# EAGLE design stroboscope (EAGLE 8.6.0)
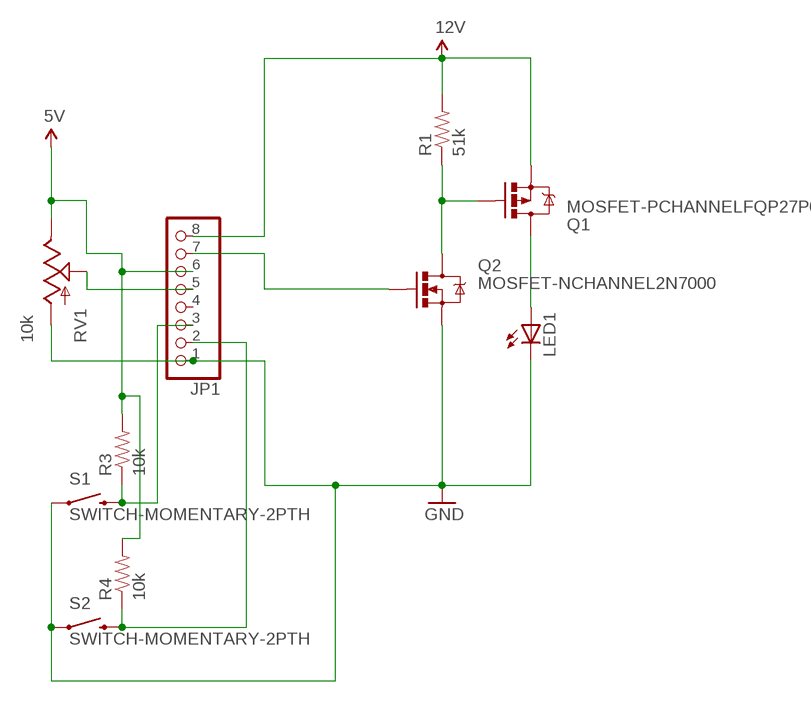
[diagram p0: schematic, sheet 1]

## Parts
JP1  PINHD-1X8BIG  [1X08-BIG]
LED1  LEDSQR2X5  [LED2X5]
Q1  MOSFET-PCHANNELFQP27P06  [TO220V]
Q2  MOSFET-NCHANNEL2N7000  [TO-92]
R1  51k  RESISTORPTH-1/4W  [AXIAL-0.4]
R3  10k  RESISTORPTH-1/4W  [AXIAL-0.4]
R4  10k  RESISTORPTH-1/4W  [AXIAL-0.4]
RV1  10k  POT  [ALPS_POT]
S1  SWITCH-MOMENTARY-2PTH  [TACTILE-PTH]
S2  SWITCH-MOMENTARY-2PTH  [TACTILE-PTH]

## Nets
5V: JP1.6 R3.P$2 R4.P$2 RV1.P$1(E)
12V: JP1.8 Q1.3(S) R1.P$2
GND: JP1.1 LED1.K(C) Q2.1(S) RV1.P$3(A) S1.1 S2.1
OUT: LED1.A Q1.2(D)
POT_SIG: JP1.5 RV1.P$2(S)
PWR_GATE: Q1.1(G) Q2.3(D) R1.P$1
SIG: JP1.7 Q2.2(G)
SW1_SIG: JP1.3 R3.P$1 S1.3
SW2_SIG: JP1.2 R4.P$1 S2.3
Unconnected: JP1.4

## Library data of the parts
JP1 = adafruit:PINHD-1X8: PIN HEADER
LED1 = adafruit:LED: LED OSRAM: - CHIPLED LG R971, LG N971, LY N971, LG Q971, LY Q971, LO R971, LY R971 LH N974, LH R974 LS Q976, LO Q976, LY Q976 LO Q996 - Hyper CHIPLED LW Q18S LB Q993, LB Q99A, LB R99A - SideLED LS A670, LO A670, LY A670, LG A670, LP A670 LB A673, LV A673, LT A673, LW A673 LH A674 LY A675 LS A676, LA A676, LO A676, LY A676, LW A676 LS A679, LY A679, LG A679 - Hyper Micro SIDELED® LS Y876, LA Y876, LO Y876, LY Y876 LT Y87S - SmartLED LW L88C, LW L88S LB L89C, LB L89S, LG L890 LS L89K, LO L89K, LY L89K LS L896, LA L896, LO L896, LY L896 - TOPLED LS T670, LO T670, LY T670, LG T670, LP T670 LSG T670, LSP T670, LSY T670, LOP T670, LYG T670 LG T671, LOG T671, LSG T671 LB T673, LV T673, LT T673, LW T673 LH T674 LS T676, LA T676, LO T676, LY T676, LB T676, LH T676, LSB T676, LW T676 LB T67C, LV T67C, LT T67C, LS T67K, LO T67K, LY T67K, LW E67C LS E67B, LA E67B, LO E67B, LY E67B, LB E67C, LV E67C, LT E67C LW T67C LS T679, LY T679, LG T679 LS T770, LO T770, LY T770, LG T770, LP T770 LB T773, LV T773, LT T773, LW T773 LH T774 LS E675, LA E675, LY E675, LS T675 LS T776, LA T776, LO T776, LY T776, LB T776 LHGB T686 LT T68C, LB T68C - Hyper Mini TOPLED® LB M676 - Mini TOPLED Santana® LG M470 LS M47K, LO M47K, LY M47K Source: http://www.osram.convergy.de/
Q1 = SparkFun-DiscreteSemi:MOSFET-PCHANNEL: Generic PMOSFET IRLML2244 - TRANS-11153 (SOT-23 -20V -4.3A) (1.Gate 2.Source 3.Drain) FQP27P06 - COM-10349 <http://www.sparkfun.com/products/10349> (TO-220 -60V -27A) (1.Gate 2.Source 3.Drain)
Q2 = SparkFun-DiscreteSemi:MOSFET-NCHANNEL: Common NMOSFET Parts MFG P/N Store ID Prod ID FDD8780 TRANS-09984 SI7820DN TRANS-11055 FDS6630A IC-08089 2N7002PW TRANS-11151 FQP30N06L COM-10213 TRANS-10060 BSS123LT1G TRANS-08345 BSS138 TRANS-00830 BS170 2N7000
R1 R3 R4 = SparkFun-Passives:RESISTOR: Resistor Basic schematic elements and footprints for 0603, 1206, and PTH resistors.
RV1 = SparkFun-Electromechanical:POT
S1 S2 = SparkFun-Electromechanical:SWITCH-MOMENTARY-2: Various NO switches- pushbuttons, reed, etc

## Board
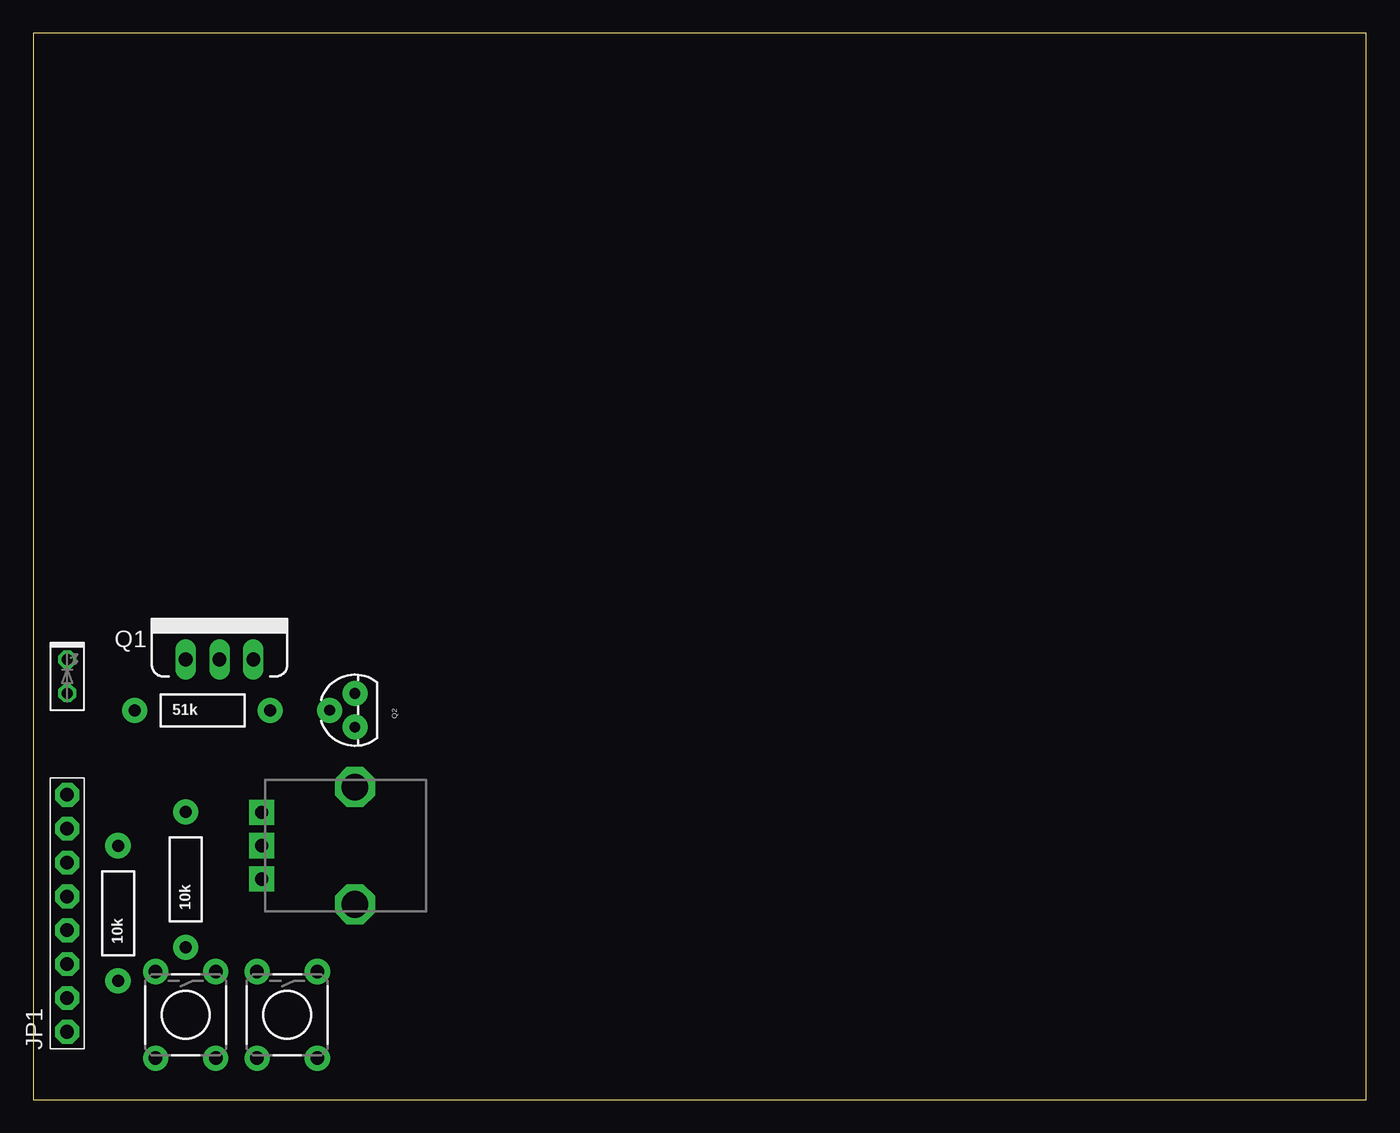
[diagram p1: board, top side]
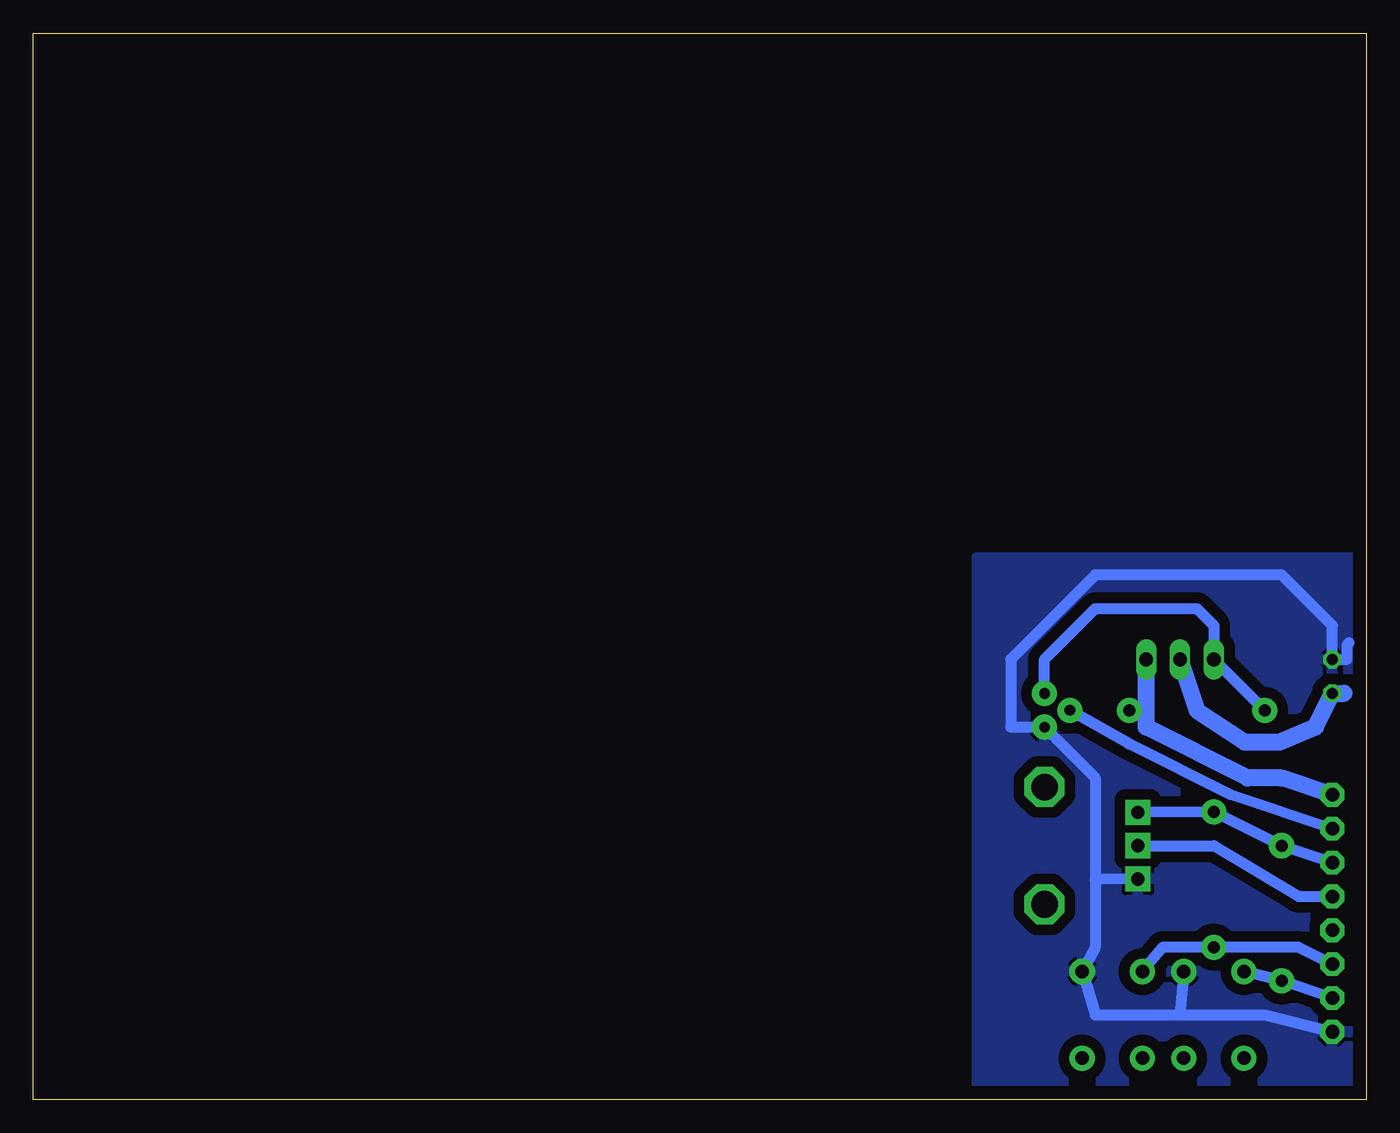
[diagram p2: board, bottom side, seen from below]

Size 100 x 80 mm. Coordinates in mm from the lower left corner, seen from the top.
Outline: 0,0 100,0 100,80 0,80 0,0
Copper layers (1*16): Top 0.035mm / dielectric 1.5mm / Bottom 0.035mm
Design rules "default": minimum track width 6mil, minimum drill 0.35mm, track to track 6mil, track to pad 6mil, pad to pad 6mil, via to via 6mil, smd to smd 6mil, copper to edge 40mil, drill to drill 6mil, minimum pad ring 10mil, minimum via ring 8mil, stop-mask expansion 4mil, vias tented up to drill 0mil, thermal gap 10mil

### Footprints (pad centres in the part's own frame; a part is rotated, then mirrored left to right if it is on the bottom)
1X08-BIG = drill 1.016 pad 1.778 octagon: 1 -8.89,0; 2 -6.35,0; 3 -3.81,0; 4 -1.27,0; 5 1.27,0; 6 3.81,0; 7 6.35,0; 8 8.89,0
LED2X5 = drill 0.813 octagon: A -1.27,0; K 1.27,0
TO220V = drill 1.016 long: 1 -2.54,0; 2 0,0; 3 2.54,0
TO-92 = drill 0.813 pad 1.88: 1 -1.27,0; 2 0,1.905; 3 1.27,0
AXIAL-0.4 = drill 0.9 pad 1.88: P$1 -5.08,0; P$2 5.08,0
ALPS_POT = drill 1 pad 1.88 square: P$1 7,-2.5; P$2 7,0; P$3 7,2.5 | drill 2 octagon: P$4 0,-4.4; P$5 0,4.4
TACTILE-PTH = drill 1.016 pad 1.88: 1 -3.251,2.261; 2 3.251,2.261; 3 -3.251,-2.261; 4 3.251,-2.261

### Placement (x,y rotation side)
JP1  2.54,13.97 90 top
LED1  2.54,31.75 90 top
Q1  13.97,33.02 0 top
Q2  24.13,29.21 90 top
R1  12.7,29.21 0 top
R3  11.43,16.51 90 top
R4  6.35,13.97 90 top
RV1  24.13,19.05 180 top
S1  19.05,6.35 270 top
S2  11.43,6.35 270 top

### Tracks (layer width: path | path; a pad name or v marks a point on that pad's centre or on a via)
5V
  Bottom 0.813: JP1.6 R4.P$2 R3.P$2 RV1.P$1
12V
  Bottom 1.27: 16.51,29.21 16.51,27.94 8.89,24.13 6.35,24.13 JP1.8 | 16.51,29.21 Q1.3 | R1.P$2 16.51,29.21
GND
  Bottom 0.813: 20.32,16.51 20.32,24.13 Q2.1 26.67,27.94 26.67,33.02 20.32,39.37 6.35,39.37 2.54,35.56 LED1.K 1.42,33.02 1.42,34.03 arc45 1.35,34.21 1.27,34.29 | 20.32,16.51 20.32,11.43 S1.1 20.32,6.35 13.97,6.35 | RV1.P$3 20.32,16.51 | 13.97,6.35 7.62,6.35 JP1.1 | S2.1 13.97,6.35
  pour Bottom (isolate 0.813): 0,40.64 29.21,40.64 29.21,0 0,0
OUT
  Bottom 1.27: Q1.2 12.7,29.21 9.12,26.82 6.49,26.82 | 6.49,26.82 6.38,26.84 | 6.49,26.82 3.81,27.94 LED1.A 1.65,30.48
POT_SIG
  Bottom 0.813: RV1.P$2 11.43,19.05 5.08,15.24 JP1.5
PWR_GATE
  Bottom 0.813: Q2.3 24.13,33.02 20.32,36.83 12.7,36.83 11.43,35.56 Q1.1 R1.P$1
SIG
  Bottom 0.813: JP1.7 10.16,22.86 17.78,26.67 Q2.2
SW1_SIG
  Bottom 0.813: JP1.3 5.08,11.43 R3.P$1 15.24,11.43 S1.3
SW2_SIG
  Bottom 0.813: JP1.2 R4.P$1 S2.3